# Altium schematic sheet 01-ESP32-ps2-blueretro.SchDoc
size A4; SheetNumber: 2; SheetTotal: 7
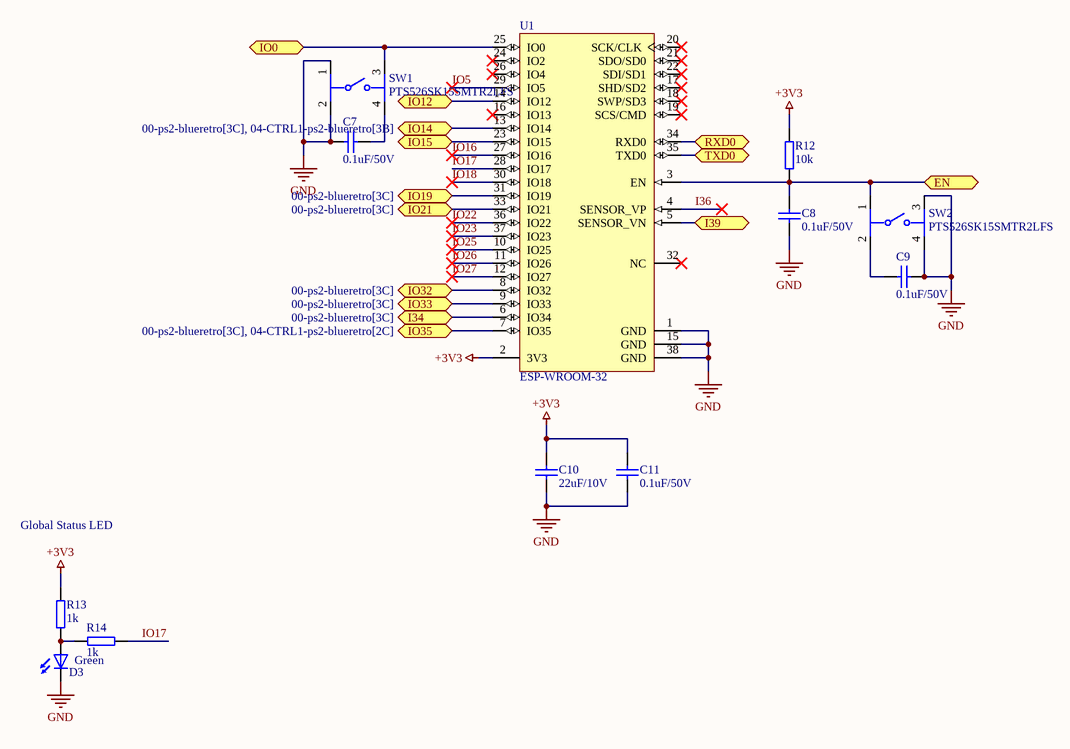
[diagram p0: 01-ESP32-ps2-blueretro.SchDoc]

## Parts
C7  value 0.1uF/50V  [cap_0603]  (hidden comment: cap_0603)
C8  value 0.1uF/50V  [cap_0603]  (hidden comment: cap_0603)
C9  value 0.1uF/50V  [cap_0603]  (hidden comment: cap_0603)
C10  value 22uF/10V  [cap_0603]  (hidden comment: cap_0603)
C11  value 0.1uF/50V  [cap_0603]  (hidden comment: cap_0603)
D3  value Green  [led0603_GREEN]  (hidden comment: led_0603)
R12  value 10k  [res_0603]  (hidden comment: res_0603)
R13  value 1k  [res_0603]  (hidden comment: res_0603)
R14  value 1k  [res_0603]  (hidden comment: res_0603)
SW1  PTS526SK15SMTR2LFS  [FP-PTS526SK15SMTR2LFS-MFG]
SW2  PTS526SK15SMTR2LFS  [FP-PTS526SK15SMTR2LFS-MFG]
U1  ESP-WROOM-32  [OLMX-ESP-WROOM-32]

## Ports
EN (bidir, see 00-ps2-blueretro[3B], 02-USB-ps2-blueretro[4A]), I34 (bidir, see 00-ps2-blueretro[3C]), I39 (bidir), IO0 (bidir, see 00-ps2-blueretro[3C], 02-USB-ps2-blueretro[4B]), IO12 (bidir, see 00-ps2-blueretro[3C], 04-CTRL1-ps2-blueretro[3B]), IO14 (bidir, see 00-ps2-blueretro[3C], 04-CTRL1-ps2-blueretro[3B]), IO15 (bidir, see 00-ps2-blueretro[3C]), IO19 (bidir, see 00-ps2-blueretro[3C]), IO21 (bidir, see 00-ps2-blueretro[3C]), IO32 (bidir, see 00-ps2-blueretro[3C]), IO33 (bidir, see 00-ps2-blueretro[3C]), IO35 (bidir, see 00-ps2-blueretro[3C], 04-CTRL1-ps2-blueretro[2C]), RXD0 (bidir, see 00-ps2-blueretro[3B], 02-USB-ps2-blueretro[4C]), TXD0 (bidir, see 00-ps2-blueretro[3B], 02-USB-ps2-blueretro[4C])

## Nets
+3V3: C10.2 C11.2 R12.1 R13.2 U1.2(3V3)
GND: C7.2 C8.1 C9.2 C10.1 C11.1 D3.2(C) SW1.1 SW1.2 SW2.3 SW2.4 U1.1(GND) U1.15(GND) U1.38(GND)
EN: C8.2 R12.2 SW2.1 U1.3(EN) ; port EN
I34: U1.6(IO34) ; port I34
I36: U1.4(SENSOR_VP)
I39: U1.5(SENSOR_VN) ; port I39
IO0: SW1.3 U1.25(IO0) ; port IO0
IO5: U1.29(IO5)
IO12: U1.14(IO12) ; port IO12
IO14: U1.13(IO14) ; port IO14
IO15: U1.23(IO15) ; port IO15
IO16: U1.27(IO16)
IO17: R14.1 U1.28(IO17)
IO18: U1.30(IO18)
IO19: U1.31(IO19) ; port IO19
IO21: U1.33(IO21) ; port IO21
IO22: U1.36(IO22)
IO23: U1.37(IO23)
IO25: U1.10(IO25)
IO26: U1.11(IO26)
IO27: U1.12(IO27)
IO32: U1.8(IO32) ; port IO32
IO33: U1.9(IO33) ; port IO33
IO35: U1.7(IO35) ; port IO35
RXD0: U1.34(RXD0) ; port RXD0
TXD0: U1.35(TXD0) ; port TXD0
NetC7_1: C7.1 SW1.4
NetC9_1: C9.1 SW2.2
NetD3_1: D3.1(A) R13.1 R14.2

Not connected (* = marked no-connect by the designer): U1 16(IO13)* 17(SHD/SD2)* 18(SWP/SD3)* 19(SCS/CMD)* 20(SCK/CLK)* 21(SDO/SD0)* 22(SDI/SD1)* 24(IO2)* 26(IO4)* 32(NC)*

## Notes on the sheet
- Global Status LED

## Library data of the parts
D3 = led_0603: Green 3,2V 20mA; Manufacturer: Würth Elektronik; Manufacturer Part Number: 150060GS75000; Supplier: Digikey; Price: 0,14; Supplier Part Number: 732-4971-1-ND; ComponentLink1Description: Supplier Link; ComponentLink1URL: https://www.digikey.at/de/products/detail/w%C3%BCrth-elektronik/150060GS75000/4489898; ComponentLink2Description: Manufacturer Link; ComponentLink2URL: *; ComponentLink3Description: Datasheet Link; ComponentLink3URL: https://www.we-online.com/components/products/datasheet/150060GS75000.pdf
SW1 SW2 = CMP-10040-000013-1: TACT 5.2 X 5.2, 1.5 MM H, 260GF,; Manufacturer: C&K; Operating Force: 250gf; Throw Configuration: SPST-NO; Contact Current Rating: 50mA; Standoff Height: 0mm; Contact Resistance: 100mΩ; Voltage Rating Dc: 12V; Electromechanical Life: 200000Cycles; Device Class L3: Tactile Switches; Device Class L2: Switches; Temperature: -20°C to +70°C; Temperature Range Low: -20°C; Package: PTS526SK15SMTR2LFS; Temperature Range High: +70°C; ComponentLink2Description: Datasheet; Device Class L1: Electromechanical; Height: 1.65mm; Digikey Description: TACT 5.2 X 5.2, 1.5 MM H, 260GF,; Category: Switch; RoHS: TRUE; Automotive: No; Lead Free: Yes; Manufacturer Part Number: PTS526SK15SMTR2LFS; Octopart: https://octopart.com/pts526+sk15+smtr2+lfs-c%26k+components-100617999; ComponentLink2URL: https://www.ckswitches.com/media/2780/pts526.pdf
U1 = CMP-2000-07454-1: Espressif System, 2.7 to 3.6 V, -40 to 85 degC, 38-Pin SMD; Manufacturer: Olimex; Package Description: 38-Pin Surface Mount Device, Body 18 x 25.5 mm, Pitch 1.27 mm; Manufacturer URL: https://www.olimex.com; RoHSCompliant: false; Mounting Technology: SurfaceMount; Datasheet Version: Rev. 2.1, 09/2017; Datasheet URL: http://www.espressif.com/sites/default/files/documentation/esp-wroom-32_datasheet_en.pdf; Package Reference: ESP-WROOM-32